# EAGLE schematic NoAgricultura (EAGLE 8.7.1)
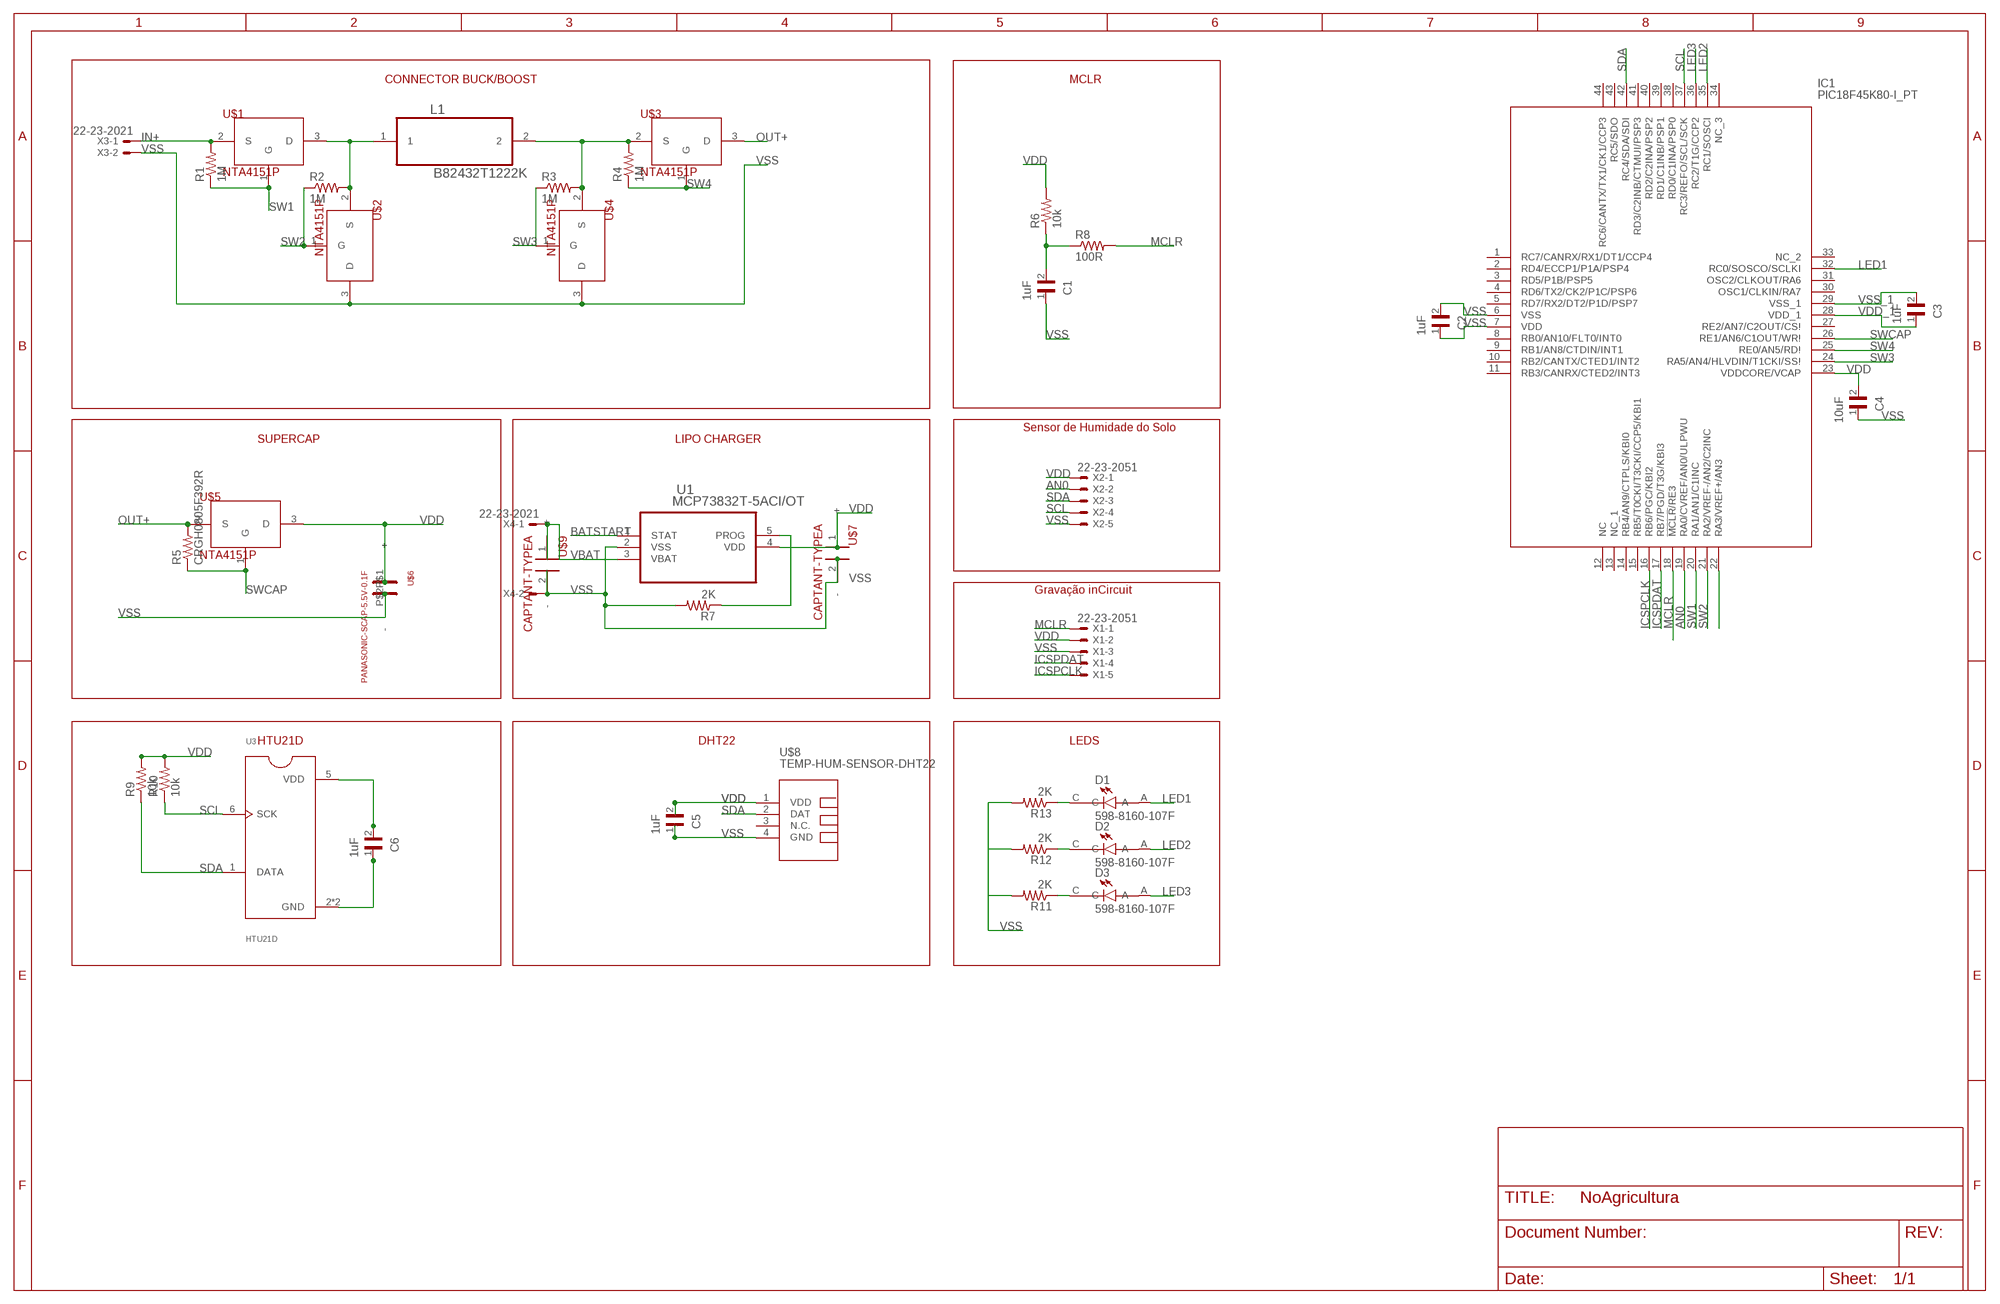
[diagram p0: schematic, sheet 1]

## Parts
C1  1uF  0805YC104KA76A  [CAPC2012X140N]
C2  1uF  0805YC104KA76A  [CAPC2012X140N]
C3  1uF  0805YC104KA76A  [CAPC2012X140N]
C4  10uF  0805YC104KA76A  [CAPC2012X140N]
C5  1uF  0805YC104KA76A  [CAPC2012X140N]
C6  1uF  0805YC104KA76A  [CAPC2012X140N]
D1  598-8160-107F  [LEDC2012X70N]
D2  598-8160-107F  [LEDC2012X70N]
D3  598-8160-107F  [LEDC2012X70N]
IC1  PIC18F45K80-I_PT  [QFP80P1200X1200X120-44N]
L1  B82432T1222K  [INDC4532X340N]
R1  1M  CRGH0805F392R  [RESC2012X65N]
R2  1M  CRGH0805F392R  [RESC2012X65N]
R3  1M  CRGH0805F392R  [RESC2012X65N]
R4  1M  CRGH0805F392R  [RESC2012X65N]
R5  CRGH0805F392R  [RESC2012X65N]
R6  10k  CRGH0805F392R  [RESC2012X65N]
R7  2K  CRGH0805F392R  [RESC2012X65N]
R8  100R  CRGH0805F392R  [RESC2012X65N]
R9  10k  CRGH0805F392R  [RESC2012X65N]
R10  10k  CRGH0805F392R  [RESC2012X65N]
R11  2K  CRGH0805F392R  [RESC2012X65N]
R12  2K  CRGH0805F392R  [RESC2012X65N]
R13  2K  CRGH0805F392R  [RESC2012X65N]
U1  MCP73832T-5ACI/OT  [SOT95P300X145-5N]
U3  HTU21D  [QFN100P300X300X100-7N]
U$1  NTA4151P  [SOT50P160X90-3N]
U$2  NTA4151P  [SOT50P160X90-3N]
U$3  NTA4151P  [SOT50P160X90-3N]
U$4  NTA4151P  [SOT50P160X90-3N]
U$5  NTA4151P  [SOT50P160X90-3N]
U$6  PANASONIC-SCAP-5.5V-0.1F  [PANASONIC-SCAP-5.5V-0.1F]
U$7  CAPTANT-TYPEA  [CAPMTANT-TYPEA]
U$8  TEMP-HUM-SENSOR-DHT22  [TEMP-HUM-SENSOR-DHT22]
U$9  CAPTANT-TYPEA  [CAPMTANT-TYPEA]
X1  22-23-2051  [22-23-2051]
X2  22-23-2051  [22-23-2051]
X3  22-23-2021  [22-23-2021]
X4  22-23-2021  [22-23-2021]

## Nets
AN0: IC1.19(RA0/CVREF/AN0/ULPWU) X2.2
BATSTART: U1.1(STAT)
ICSPCLK: IC1.16(RB6/PGC/KBI2) X1.5
ICSPDAT: IC1.17(RB7/PGD/T3G/KBI3) X1.4
IN+: R1.2 U$1.2(S) X3.1
LED1: D1.A IC1.32(RC0/SOSCO/SCLKI)
LED2: D2.A IC1.35(RC1/SOSCI)
LED3: D3.A IC1.36(RC2/T1G/CCP2)
MCLR: R8.2 X1.1
N$1: L1.1 R2.2 U$1.3(D) U$2.2(S)
N$2: L1.2 R3.2 R4.2 U$3.2(S) U$4.2(S)
N$3: D1.C R13.1
N$4: R7.1 U1.5(PROG)
N$5: D2.C R12.1
N$6: IC1.22(RA3/VREF+/AN3)
N$7: C1.2 R6.1 R8.1
N$8: D3.C R11.1
N$9: C6.1 U3.2(GND) U3.PAD(GND)
N$10: C6.2 U3.5(VDD)
N$14: R11.2
N$15: R12.2
OUT+: R5.2 U$3.3(D) U$5.2(S)
SCL: IC1.37(RC3/REFO/SCL/SCK) R10.1 U3.6(SCK) X2.4
SDA: IC1.42(RC4/SDA/SDI) R9.1 U3.1(DATA) U$8.2(DAT) X2.3
SW1: IC1.20(RA1/AN1/C1INC) R1.1 U$1.1(G)
SW2: IC1.21(RA2/VREF-/AN2/C2INC) R2.1 U$2.1(G)
SW3: IC1.24(RA5/AN4/HLVDIN/T1CKI/SS!) R3.1 U$4.1(G)
SW4: IC1.25(RE0/AN5/RD!) R4.1 U$3.1(G)
SWCAP: IC1.26(RE1/AN6/C1OUT/WR!) R5.1 U$5.1(G)
VBAT: U1.3(VBAT) U$9.1(+) X4.1
VDD: C4.2 C5.2 IC1.23(VDDCORE/VCAP) R6.2 R9.2 R10.2 U1.4(VDD) U$5.3(D) U$6.P$1(+) U$7.1(+) U$8.1(VDD) X1.2 X2.1
VDD_1: C3.1 IC1.28(VDD_1)
VSS: C1.1 C2.1 C2.2 C4.1 C5.1 IC1.6(VSS) IC1.7(VDD) R7.2 R13.2 U1.2(VSS) U$2.3(D) U$4.3(D) U$6.P$2(-) U$7.2(-) U$8.4(GND) U$9.2(-) X1.3 X2.5 X3.2 X4.2
VSS_1: C3.2 IC1.29(VSS_1)
Unconnected: IC1.1(RC7/CANRX/RX1/DT1/CCP4) IC1.2(RD4/ECCP1/P1A/PSP4) IC1.3(RD5/P1B/PSP5) IC1.4(RD6/TX2/CK2/P1C/PSP6) IC1.5(RD7/RX2/DT2/P1D/PSP7) IC1.8(RB0/AN10/FLT0/INT0) IC1.9(RB1/AN8/CTDIN/INT1) IC1.10(RB2/CANTX/CTED1/INT2) IC1.11(RB3/CANRX/CTED2/INT3) IC1.12(NC) IC1.13(NC_1) IC1.14(RB4/AN9/CTPLS/KBI0) IC1.15(RB5/T0CKI/T3CKI/CCP5/KBI1) IC1.18(!MCLR!/RE3) IC1.27(RE2/AN7/C2OUT/CS!) IC1.30(OSC1/CLKIN/RA7) IC1.31(OSC2/CLKOUT/RA6) IC1.33(NC_2) IC1.34(NC_3) IC1.38(RD0/C1INA/PSP0) IC1.39(RD1/C1INB/PSP1) IC1.40(RD2/C2INA/PSP2) IC1.41(RD3/C2INB/CTMUI/PSP3) IC1.43(RC5/SDO) IC1.44(RC6/CANTX/TX1/CK1/CCP3) U$8.3(N.C.)

## Notes on the sheet
- CONNECTOR BUCK/BOOST | MCLR
- Sensor de Humidade do Solo
- SUPERCAP | LIPO CHARGER
- Gravação inCircuit
- HTU21D | DHT22 | LEDS

## Library data of the parts
C1-C6 = 0805YC104KA76A:0805YC104KA76A: Cap Ceramic 0.1uF 16V X7R 10% SMD 0805 125°C Waffle; AVAILABILITY: Unavailable; DESCRIPTION: Cap Ceramic 0.1uF 16V X7R 10% SMD 0805 125°C Waffle; MF: AVX; MP: 0805YC104KA76A; PACKAGE: 0805 AVX; PRICE: None
D1-D3 = led0805:598-8160-107F: LED, 0805, YELLOW/GREEN, 40MCD,; AVAILABILITY: Unavailable; DESCRIPTION: LED, SMD; 0805; Yellow-Green; Water Clear Lens; 40mcd; 570/575nm; MF: Dialight; MP: 598-8160-107F; PACKAGE: 0805 Dialight; PRICE: None
IC1 = PIC18F45K80-I_PT:PIC18F45K80-I_PT: MCU, 32kB Flash, ECAN, 12-bit ADC, CTMU Source: Datasheet <http://docs-emea.rs-online.com/webdocs/0f3b/0900766b80f3b175.pdf>; ALLIED_NUMBER: 70047564; ALLIED_PRICE-STOCK: http://www.alliedelec.com/microchip-technology-inc-pic18f45k80-i-pt/70047564/; DESCRIPTION: MCU, 32kB Flash, ECAN, 12-bit ADC, CTMU; HEIGHT: 1.2mm; MANUFACTURER_NAME: Microchip; MANUFACTURER_PART_NUMBER: PIC18F45K80-I/PT; MOUSER_PART_NUMBER: 579-PIC18F45K80-I/PT; MOUSER_PRICE-STOCK: https://www.mouser.com/Search/Refine.aspx?Keyword=579-PIC18F45K80-I%2FPT; RS_PART_NUMBER: 8895477; RS_PRICE-STOCK: http://uk.rs-online.com/web/p/products/8895477
L1 = B82432T1222K:B82432T1222K: SMT inductors; AVAILABILITY: Unavailable; DESCRIPTION: Ind Chip Molded Wirewound 2.2uH 10% 7.96MHz 10Q-Factor Ferrite 1A 1812 Blister T/R; MF: EPCOS; MP: B82432T1222K; PACKAGE: 1812 EPCOS; PRICE: None
R1-R13 = 0805 Resistor:CRGH0805F392R: RES SMD 392 OHM 1% 1/3W 0805; AVAILABILITY: Unavailable; COMMENT: 5-1879509-5; DESCRIPTION: Res Thick Film 0805 392 Ohm 1% 1/3W ±100ppm/°C Molded SMD SMD T/R; MF: TE Connectivity; MP: CRGH0805F392R; PACKAGE: 0805 TE Connectivity; PRICE: None; TE_PURCHASE_URL: https://www.te.com/usa-en/product-5-1879509-5.html?te_bu=Cor&te_type=disp&te_campaign=seda_glo_cor-seda-global-disp-prtnr-fy19-seda-model-bom-cta_sma-317_1&elqCampaignId=32493
U1 = MCP73832T-5ACI_OT:MCP73832T-5ACI/OT: IC, BATT CHARGER, Li-Ion Li-Polymer, 500 mA; AVAILABILITY: Unavailable; DESCRIPTION: Tiny Integrated Li-Ion/Li-Poly Charge mgnt controller, 4.5V Vreg out; MF: Microchip; MP: MCP73832T-5ACI/OT; PACKAGE: SOT-23 Microchip; PRICE: None
U3 = HTU21D:HTU21D: Digital Relative Humidity sensor with Temperature output; AVAILABILITY: Unavailable; COMMENT: CAT-HSC0004; DESCRIPTION: Temp Sensor Digital Serial _2-Wire, I2C_ 6-Pin DFN; MF: TE Connectivity; MP: HTU21D; PACKAGE: DFN-6 Measurement Specialties; PRICE: None; TE_PURCHASE_URL: https://www.te.com/usa-en/product-CAT-HSC0004.html?te_bu=Cor&te_type=disp&te_campaign=seda_glo_cor-seda-global-disp-prtnr-fy19-seda-model-bom-cta_sma-317_1&elqCampaignId=32493
U$1-U$5 = nta4151p:NTA4151P
U$6 = SCAP-PANASONIC5.5V1F5MM20MM:PANASONIC-SCAP-5.5V-0.1F
U$7 U$9 = CAPTANT-TYPEA:CAPTANT-TYPEA
U$8 = diy-modules:TEMP-HUM-SENSOR-DHT22: DHT22 - digital humidity & temperature sensor Also known as: AM2302 AM2302 datasheet available here: http://akizukidenshi.com/download/ds/aosong/AM2302.pdf Click here to find device on ebay.com <http://www.ebay.com/sch/dht22+digital+sensor>
X1 X2 = con-molex:22-23-2051: .100" (2.54mm) Center Header - 5 Pin; MF: MOLEX; MPN: 22-23-2051; OC_FARNELL: 1462952; OC_NEWARK: 38C9178
X3 X4 = con-molex:22-23-2021: .100" (2.54mm) Center Header - 2 Pin; MF: MOLEX; MPN: 22-23-2021; OC_FARNELL: 1462926; OC_NEWARK: 25C3832